# Altium schematic sheet 10_Mains_Input.SchDoc
size A4; Organization: NYUAD; Revision: 03; SheetNumber: 01; SheetTotal: 04
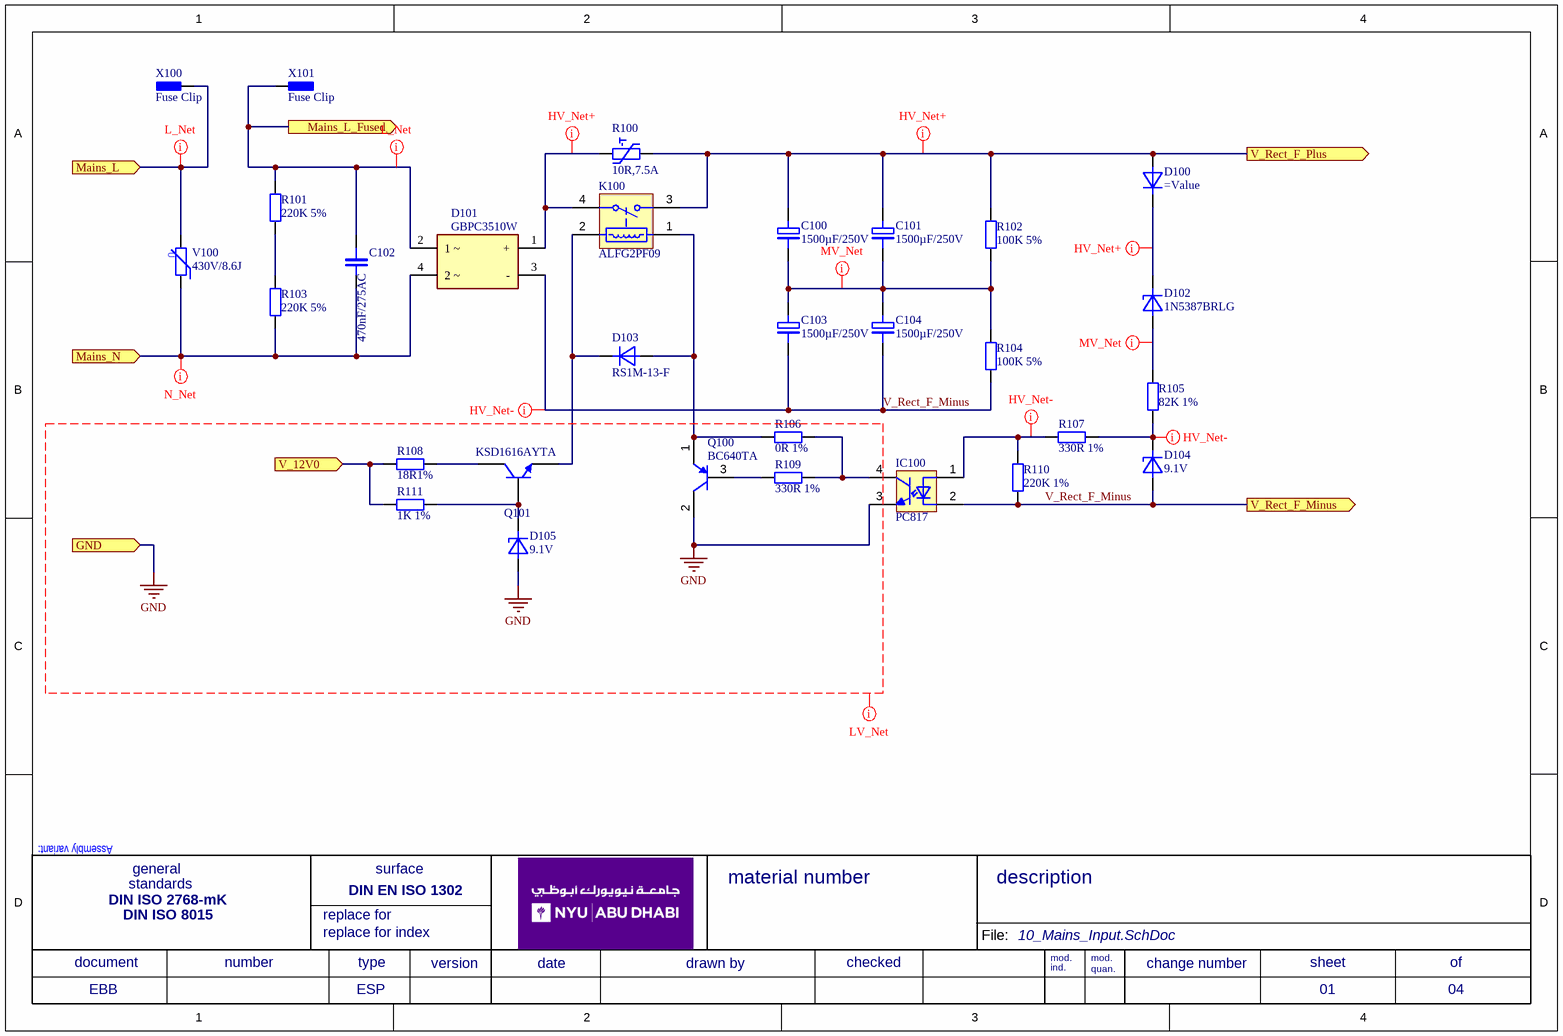
[diagram p0: 10_Mains_Input.SchDoc]

## Parts
C100  1500µF/250V  [CAPACITOR-ELKO-400V-RM10-35x50]
C101  1500µF/250V  [CAPACITOR-ELKO-400V-RM10-35x50]
C102  470nF/275AC  [CP22.5x10x26.5]
C103  1500µF/250V  [CAPACITOR-ELKO-400V-RM10-35x50]
C104  1500µF/250V  [CAPACITOR-ELKO-400V-RM10-35x50]
D100  (no value)  [SMA]
D101  GBPC3510W  [GBPC3510W]
D102  1N5387BRLG  [DO-201AD]
D103  RS1M-13-F  [SMA]
D104  9.1V  [DO-201AD]
D105  9.1V  [DO-201AD]
IC100  PC817  [DIP04]
K100  ALFG2PF09  [ALFG2PF09]
Q100  BC640TA  [TO-92]
Q101  KSD1616AYTA  [TO-92]
R100  10R,7.5A  [NTC_D10_P7.5]
R101  220K 5%  [EIA1206]
R102  100K 5%  [RES-RM20-RSF2W]
R103  220K 5%  [EIA1206]
R104  100K 5%  [RES-RM20-RSF2W]
R105  82K 1%  [EIA1206]
R106  0R 1%  [EIA0603]
R107  330R 1%  [EIA0603]
R108  18R1%  [EIA1206]
R109  330R 1%  [EIA0603]
R110  220K 1%  [EIA0603]
R111  1K 1%  [EIA1206]
V100  430V/8.6J  [EPCOS_B72205S0271K101]
X100  Fuse Clip  [Fuse_Clip_01020071Z]
X101  Fuse Clip  [Fuse_Clip_01020071Z]

## Ports
GND (in), Mains_L (in), Mains_L_Fused (out), Mains_N (in), V_12V0 (in), V_Rect_F_Minus (out), V_Rect_F_Plus (out)

## Nets
GND: D105.A IC100.3 Q100.2(C) ; port GND
Mains_L: V100.2 X100.1 ; port Mains_L
Mains_L_Fused: C102.2 D101.2(1_~) R101.2 X101.1 ; port Mains_L_Fused
Mains_N: C102.1 D101.4(2_~) R103.1 V100.1 ; port Mains_N
V_12V0: R108.2 R111.2 ; port V_12V0
V_Rect_F_Minus: C103.2 C104.2 D101.3(-) D104.A IC100.2 R104.1 R110.1 ; port V_Rect_F_Minus
V_Rect_F_Plus: C100.1 C101.1 D100.A K100.3(NO) R100.2 R102.2 ; port V_Rect_F_Plus
NetC100_2: C100.2 C101.2 C103.1 C104.1 R102.1 R104.2
NetD100_K: D100.K D102.K
NetD101_1: D101.1(+) K100.4(COM) R100.1
NetD102_A: D102.A R105.2
NetD103_A: D103.A K100.1 Q100.1(E) R106.2
NetD103_K: D103.K K100.2 Q101.1(E)
NetD104_K: D104.K R105.1 R107.2
NetD105_K: D105.K Q101.3(B) R111.1
NetIC100_1: IC100.1 R107.1 R110.2
NetIC100_4: IC100.4 R106.1 R109.1
NetQ100_3: Q100.3(B) R109.2
NetQ101_2: Q101.2(C) R108.1
NetR101_1: R101.1 R103.2

## Layout directives
net class N_Net: Mains_N
net class L_Net: Mains_L, Mains_L_Fused
net class HV_Net+: NetD100_K, NetD101_1, V_Rect_F_Plus
net class MV_Net: NetC100_2, NetD102_A
net class HV_Net-: NetD104_K, NetIC100_1, V_Rect_F_Minus
net class LV_Net: GND

## Notes on the sheet
- Assembly variant:
- DIN ISO 2768-mK
- DIN ISO 8015
- standards
- general
- replace for
- DIN EN ISO 1302
- surface
- material number
- description
- document
- number
- replace for index
- type
- version
- date
- drawn by
- checked
- File:
- mod.
- ind.
- quan.
- change number
- sheet
- of
- EBB
- ESP
- (in symbol B72205S0271K101) U

## Library data of the parts
C100 C101 C103 C104 = SLP152M250H9P3: 1500µF, 250V, Radial, 3000HRS; Manufacturer: Cornell; ID: 45; Verified Lib: False; Manufacturer P/N: SLP152M250H9P3; Category: Elco; Part_Value: 1500µF/250V; Package/Case: D35mmH50mmP10mm; Supplier-1: Digkey; Price: 7.5; created by: Hamad; created On: 8/12/2021
C102 = R49AN347050B1M: X2 Capacitor, 275VAC, l=26.5, w=8.5, h=16.5, pitch=22.5mm, 20%; Manufacturer: Kemet; ID: 44; Verified Lib: False; Manufacturer P/N: R49AN347050B1M; Category: Film; Part_Value: 470nF/275AC; Package/Case: D10mmH22mmP5mm; Supplier-1: Digkey; Price: 0.25; created by: Hamad; created On: 8/12/2021
D100 D103 = RS1M-13-F: 1KV,1A,500ns, SMA; Manufacturer: Diodes; ID: 17; Our Stock: 30; Verified Lib: False; Manufacturer P/N: RS1M-13-F; Category: Gen Purpose; Part_Value: RS1M-13-F; Package/Case: SMA; Supplier-1: LCSC; Supplier-2: Digikey; Price: 0.09; created by: HamadA; created on: 8/13/2021
D101 = GBPC3510W: Rectififer bridge 35A 100V; Manufacturer: Taiwan Semi; ID: 15; Our Stock: 5; Verified Lib: False; Manufacturer P/N: GBPC3510W; Category: Bridge Rectifier; Part_Value: GBPC3510W; Package/Case: THT; Supplier-1: LCSC; Supplier-2: Digikey; Price: 1.9; created by: HamadA; created on: 8/11/2021
D102 = 1N5387BRLG: Zener, 190V, 5%, 500nA@144V, Axial; Manufacturer: On Semi; ID: 18; Our Stock: 30; Verified Lib: False; Manufacturer P/N: 1N5387BRLG; Category: Zener; Part_Value: 1N5387BRLG; Package/Case: DO-201AD; Supplier-1: LCSC; Supplier-2: Digikey; Price: 0.38; created by: HamadA; created on: 8/13/2021
D104 D105 = BZX79C9V1: Zener, 9.1V, 5%,0.5Watt, Axial; Manufacturer: NXP; ID: 19; Our Stock: 30; Verified Lib: False; Manufacturer P/N: BZX79C9V1; Category: Zener; Part_Value: 9.1V; Package/Case: DO-201AD; Supplier-1: LCSC; Supplier-2: Digikey; Price: 0.09; created by: HamadA; created on: 8/13/2021
IC100 = PC817: Optocoupler, 1CH, DIP.4, 5KV; Manufacturer: UTC,Sharp; Parts availabe: 80; ID: 33; Our Stock: 30; Verified Lib: False; Manufacturer P/N: PC817; Category: Optocoupler; Part_Value: PC817; Package/Case: DIP04; Supplier-1: Digikey; Price: 0.05; created On: 8/13/2021
K100 = ALFG2PF09: General Purpose Relay SPST-NO (1 Form A) 9VDC Coil Through Hole; Manufacturer: Panasonic; Part_Value: SPST 31A; Electrical Life: 3x10^4; Nominal Operating Power: 1400 mW; Packing: Carton, Case; Mechanical Life(Min.operation): 1x10^6; Coil Voltage: 9 V; Max Switching Current: 31 A AC; Pb-Free: True; Max Switching Voltage: 250 V AC; ID: 1; Verified Lib: False; PartNumber: ALFG2PF09; ComponentLink2Description: Datasheet; DatasheetVersion: 201402-T; ComponentLink3URL: http://www3.panasonic.biz/ac/e_download/control/relay/power/catalog/mech_eng_lfg.pdf?f_cd=300272; ComponentLink3Description: Package Specification; ComponentLink1URL: http://www3.panasonic.biz/ac/ae/index.jsp; ComponentLink2URL: http://www3.panasonic.biz/ac/e_download/control/relay/power/catalog/mech_eng_lfg.pdf?f_cd=300272; PackageReference: LF-G-4-3010x1570x2330; ComponentLink1Description: Manufacturer URL; PackageVersion: ASCTB196E, 02/2014; RoHS: True; Series: LF-G Relays; Mounting Technology: Through Hole; PackageDescription: 4-Pin Through Hole Terminal Package, Body 30.1 x 15.7 mm; Manufacturer P/N: ALFG2PF09; Category: SPST; Package/Case: THT; Supplier-1: Digikey; Supplier-2: Digikey; Price: 7; created by: Hamad; created On: 8/12/2021
Q100 = BC640TA: 80V, 1A, 250mW, 100MHz,TO-92; Manufacturer: On Semi; Alternative Part: yes; ID: 18; Verified Lib: False; Manufacturer P/N: BC640TA; Category: PNP; Part_Value: BC640TA; Package/Case: TO-92; Supplier-1: LCSC; Price: 0.012; created by: HamadA; Create on: 8/12/2021
Q101 = KSD1616AYTA: 60V, 1A, 250mW, 160MHz, TO-92; Manufacturer: On Semi; Alternative Part: yes; ID: 19; Verified Lib: False; Manufacturer P/N: KSD1616AYTA; Category: NPN; Part_Value: KSD1616AYTA; Package/Case: TO-92; Supplier-1: LCSC; created by: HamadA; Create on: 8/12/2021
R100 = B57364S100M54: Inrush Current Limiter 10 Ohms ±20% 7.5 A 0.827" (21.00mm); Manufacturer: Epcos; ID: 18; Our Stock: 10; Verified Lib: False; Manufacturer P/N: B57364S100M54; Category: THT NTC; Part_Value: 10R,7.5A; Package/Case: THT P7.5mm; Supplier-1: Digikey; Price: 1.2; created by: HamadA; Created On: 8/12/2021
R101 R103 = R_Open_1206: Chip Resistor 1206; Manufacturer P/N: CRCW1206220KJNEAHP; Manufacturer: Vishay; ID: 15; Verified Lib: False; Category: Chip Resistor; Part_Value: 220K 5%; Package/Case: 1206; Supplier-1: LCSC; Price: 0.01; created by: HamadA
R102 R104 = ERG-2SJ513: Metal Oxide Film, 2W, 51000ohm, 350V, 5% +/-Tol, 350ppm/Ce; Manufacturer: Panasonic; ID: 19; Verified Lib: False; Manufacturer P/N: ERG-2SJ513; Category: 2W; Part_Value: 100K 5%; Package/Case: THT RM20 mm; Supplier-1: Digikey; Price: 0.11; created by: HamadA
R105 R108 R111 = R_Open_1206: Chip Resistor 1206; Manufacturer: open source; ID: 15; Verified Lib: False; Manufacturer P/N: R_Open_1206; Category: Chip Resistor; Package/Case: 1206; Supplier-1: LCSC; Price: 0.01; created by: HamadA
  R105: Part_Value: 82K 1%
  R108: Part_Value: 18R1%
  R111: Part_Value: 1K 1%
R106 R107 R109 R110 = R_Open_0603: Chip Resistor 0603; Manufacturer: open source; ID: 16; Verified Lib: False; Manufacturer P/N: R_Open_0603; Category: Chip Resistor; Package/Case: 0603; Supplier-1: LCSC; Price: 0.005; created by: HamadA
  R106: Part_Value: 0R 1%
  R107 R109: Part_Value: 330R 1%
  R110: Part_Value: 220K 1%
V100 = B72205S0271K101: 430 V 400 A Varistor 1 Circuit Through Hole Disc 5mm; Manufacturer: EPCOS; ID: 1; Verified Lib: False; Manufacturer P/N: B72205S0271K101; Category: Varistor; Part_Value: 430V/8.6J; Package/Case: THT; Supplier-1: LCSC; Price: 0.04; created by: Hamad; created On: 8/12/2021
X100 X101 = 01020071Z: Fuse Clip, 1/4" Fuses, Littlefuse, THT; ID: 3; Our Stock: 30; Verified Lib: False; Manufacturer P/N: 01020071Z; Category: Fuse Holder; Manufacturer: LittleFuse; Part_Value: Fuse Clip; Package/Case: THT; Supplier-1: Mouser; Price: 0.24; created by: Hamad; created On: 10/10/2021